# EasyEDA Pro project ProProject_平衡小车_2024-06-28.epro

# Schematic Schematic1
Create Date: 2024-05-16; Page Name: P1; Project Name: 平衡小车; Schematic Name: Schematic1; Update Date: 2024-05-18; Company: 嘉立创EDA; Drawed: bbbsk; Page Size: A4; Reviewed: bbbsk; Version: V1.0
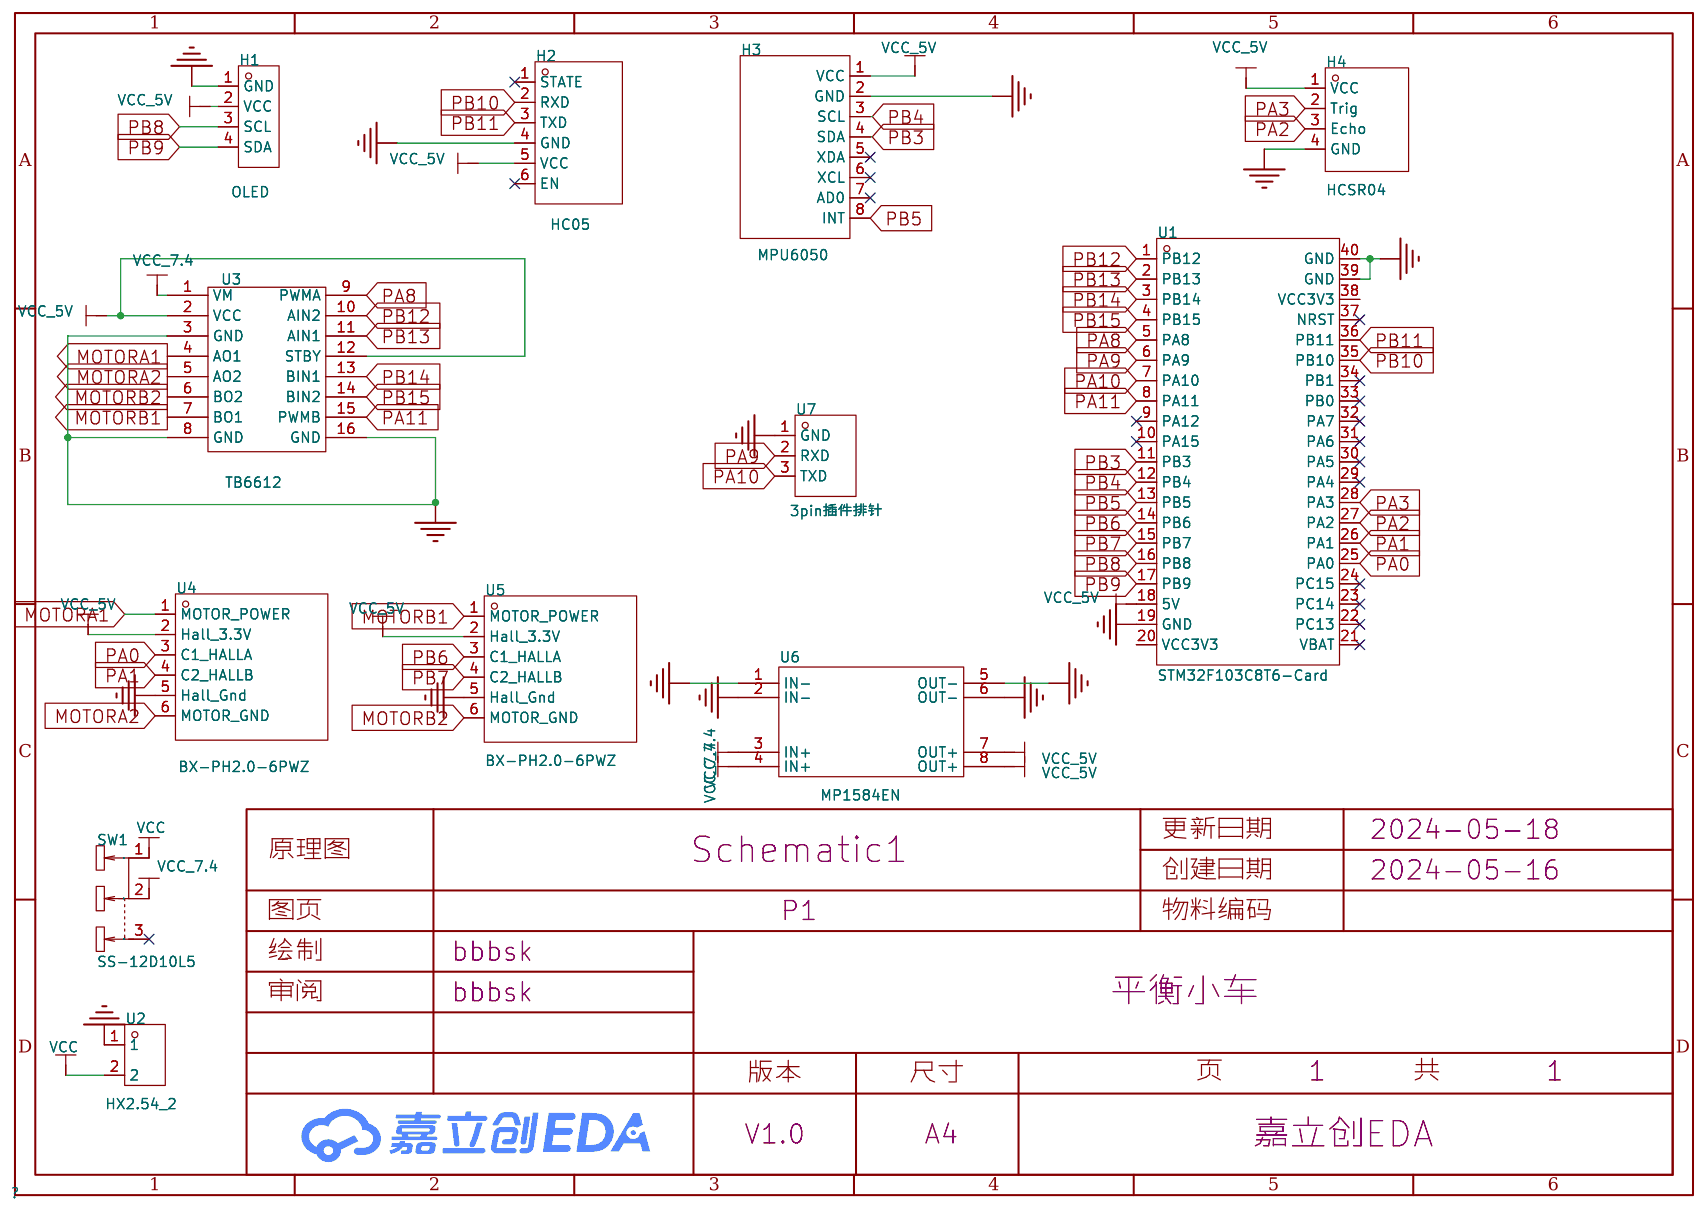
[diagram p0: schematic sheet]

## Parts
H1  OLED  [HDR-TH_4P-P2.54-V-F]
H2  HC05  [HDR-TH_6P-P2.54-V-F]
H3  MPU6050  [HDR-TH_8P-P2.54-V-F-1]
H4  HCSR04  [HDR-TH_4P-P2.54-V-F]
SW1  SS-12D10L5  [SW-TH_SS-12D10L5]
U1  STM32F103C8T6-Card  [CONN-TH_L53.3-W22.9_STM32F103C8T6-CARD]
U2  HX2.54_2  [CONN-TH_2P-P2.50_HX254]
U3  TB6612  [TB6612]
U4  BX-PH2.0-6PWZ  [CONN-TH_6P-P2.00_BX-PH2.0-6PWZ]
U5  BX-PH2.0-6PWZ  [CONN-TH_6P-P2.00_BX-PH2.0-6PWZ]
U6  MP1584EN  [MP1584EN]
U7  3pin插件排针  [HDR-TH_3P-P2.00-V-M]

## Library data of the parts
H1 = OLED排母: 插孔结构:1x4P;间距:2.54mm;行距:-;圆孔/方孔:方孔;安装类型:直插;排数:单排;总孔位数:4P;额定电流:3A;额定电压:-;插孔方向:顶部;塑高:-;触头材质:青铜;触头镀层:-;工作温度范围:-40℃~+105℃;焊接温度(最大值):-;; LCSC Part Name: 间距:2.54mm 1x4P 直插; Supplier Part: C2718488; Manufacturer: BOOMELE(博穆精密); Manufacturer Part: 2.54-1*4P母; Supplier Footprint: 插件,P=2.54mm; JLCPCB Part Class: 扩展库; Datasheet: https://atta.szlcsc.com/upload/public/pdf/source/20210301/C2718488_F4427B881E42CAA8DDB0B1C12B3A522C.pdf; Supplier: LCSC; Holes Structure: 1x4P; Pitch: 2.54mm; Circular Hole / Square Hole: 方孔; Mounting Type: 直插; Number of Rows: 单排; Number of Holes: 4P; Current Rating (Max): 3A; Holes Direction: 顶部; Contact Material: 青铜; Operating Temperature Range: -40℃~+105℃
H2 = HC05: 插孔结构:1x6P;间距:2.54mm;行距:-;安装类型:直插;排数:单排;总孔位数:6P;塑高:-;触头材质:-;触头镀层:-;; LCSC Part Name: 间距:2.54mm 1x6P 直插; Supplier Part: C40877; Manufacturer: BOOMELE(博穆精密); Manufacturer Part: 2.54-1*6P母; Supplier Footprint: 插件,P=2.54mm; JLCPCB Part Class: 扩展库; Datasheet: https://atta.szlcsc.com/upload/public/pdf/source/20210301/C2718488_F4427B881E42CAA8DDB0B1C12B3A522C.pdf; Supplier: LCSC; Holes Structure: 1x6P; Pitch: 2.54mm; Mounting Type: 直插; Number of Rows: 单排; Number of Holes: 6P
H3 = MPU6050: 插孔结构:1x8P;间距:2.54mm;行距:-;安装类型:直插;排数:单排;总孔位数:8P;塑高:-;触头材质:-;触头镀层:-;; LCSC Part Name: 间距:2.54mm 1x8P 直插; Supplier Part: C27438; Manufacturer: BOOMELE(博穆精密); Manufacturer Part: 2.54-1*8P母环保; Supplier Footprint: 插件,P=2.54mm; JLCPCB Part Class: 扩展库; Datasheet: https://atta.szlcsc.com/upload/public/pdf/source/20231221/1CA800C6799ED97958773716FAA1BFFE.pdf; Supplier: LCSC; Holes Structure: 1x8P; Pitch: 2.54mm; Mounting Type: 直插; Number of Rows: 单排; Number of Holes: 8P
H4 = HCSR04: 插孔结构:1x4P;间距:2.54mm;行距:-;圆孔/方孔:方孔;安装类型:直插;排数:单排;总孔位数:4P;额定电流:3A;额定电压:-;插孔方向:顶部;塑高:-;触头材质:青铜;触头镀层:-;工作温度范围:-40℃~+105℃;焊接温度(最大值):-;; LCSC Part Name: 间距:2.54mm 1x4P 直插; Supplier Part: C2718488; Manufacturer: BOOMELE(博穆精密); Manufacturer Part: 2.54-1*4P母; Supplier Footprint: 插件,P=2.54mm; JLCPCB Part Class: 扩展库; Datasheet: https://atta.szlcsc.com/upload/public/pdf/source/20210301/C2718488_F4427B881E42CAA8DDB0B1C12B3A522C.pdf; Supplier: LCSC; Holes Structure: 1x4P; Pitch: 2.54mm; Circular Hole / Square Hole: 方孔; Mounting Type: 直插; Number of Rows: 单排; Number of Holes: 4P; Current Rating (Max): 3A; Holes Direction: 顶部; Contact Material: 青铜; Operating Temperature Range: -40℃~+105℃
SW1 = SS-12D10L5: 电路结构:单刀双掷;安装方式:直插;开关颜色:黑色;额定电流(DC):3A;额定电压(DC):125V;额定电流(AC):3A;额定电压(AC):125V;机械寿命:1万次;; LCSC Part Name: 柄长5mm 直插双档 滑动开关; Supplier Part: C319012; Manufacturer: XKB Connectivity(中国星坤); Supplier Footprint: 插件; JLCPCB Part Class: 扩展库; Datasheet: https://atta.szlcsc.com/upload/public/pdf/source/20211009/D6412F37AABE6F9459A6EE7FA4DAEADB.pdf; Supplier: LCSC; Circuit: 单刀双掷; Actuator Style: 矩形柱状; Pin Style: PC引脚; Switch Length: 13mm; Switch Width: 6.8mm; Switch Height: 6.4mm; Mounting Style: 直插; Actuator Color: 黑色; Current Rating (DC): 3A; Voltage Rating (DC): 125V; Current Rating (AC): 3A; Voltage Rating (AC): 125V; Mechanical Life: 1万次; Operating Temperature: -40℃~+85℃
U1 = STM32F103C8T6-Card: Supplier Part: C9900077949; Supplier Footprint: 插件; Supplier: LCSC
U2 = HX2.54_2: Supplier Part: C9900001962; Supplier Footprint: CONN-TH_2P-P2.50; JLCPCB Part Class: 扩展库; Supplier: LCSC
U3 = TB6612
U4 U5 = BX-PH2.0-6PWZ: 插针结构:1x6P;间距:2mm;安装方式:弯插;参考系列:PH;总PIN数:6P;排数:1;每排PIN数:6;行距:-;额定电流:2A;触头材质:黄铜;触头镀层:锡;工作温度范围:-25℃~+85℃;; Supplier Part: C18077757; Manufacturer: Bossie(博锡); Supplier Footprint: 弯插,P=2mm; JLCPCB Part Class: 扩展库; Datasheet: https://atta.szlcsc.com/upload/public/pdf/source/20231017/ADE7E4C0A5BEBBBF1476E376B8A5AD42.pdf; Supplier: LCSC; Pins Structure: 1x6P; Pitch: 2mm; Mounting Style: 弯插; Reference Series: PH; Number of Pins: 6P; Number of Rows: 1; Number of PINs Per Row: 6; Current Rating (Max): 2A; Contact Material: 黄铜; Contact Plating: 锡; Operating Temperature Range: -25℃~+85℃
U6 = MP1584EN
U7 = 串口调试: Supplier Part: C9900022322; Supplier Footprint: HDR-TH-3P; JLCPCB Part Class: 扩展库; Supplier: LCSC

## Nets
GND: H1.1(GND) H2.4(GND) H3.2(GND) H4.4(GND) U1.19(GND) U1.39(GND) U1.40(GND) U2.1 U3.3(GND) U3.8(GND) U3.16(GND) U4.5(Hall_Gnd) U5.5(Hall_Gnd) U6.1(IN-) U6.2(IN-) U6.5(OUT-) U6.6(OUT-) U7.1(GND)
VCC: SW1.1 U2.2
VCC_5V: H1.2(VCC) H2.5(VCC) H3.1(VCC) H4.1(VCC) U1.18(5V) U3.2(VCC) U3.12(STBY) U4.2(Hall_3.3V) U5.2(Hall_3.3V) U6.7(OUT+) U6.8(OUT+)
VCC_7.4: SW1.2 U3.1(VM) U6.3(IN+) U6.4(IN+)
MOTORA1: U3.4(AO1) U4.1(MOTOR_POWER)
MOTORA2: U3.5(AO2) U4.6(MOTOR_GND)
MOTORB1: U3.7(BO1) U5.1(MOTOR_POWER)
MOTORB2: U3.6(BO2) U5.6(MOTOR_GND)
PA0: U1.25(PA0) U4.3(C1 HALLA)
PA1: U1.26(PA1) U4.4(C2 HALLB)
PA2: H4.3(Echo) U1.27(PA2)
PA3: H4.2(Trig) U1.28(PA3)
PA8: U1.5(PA8) U3.9(PWMA)
PA9: U1.6(PA9) U7.2(RXD)
PA10: U1.7(PA10) U7.3(TXD)
PA11: U1.8(PA11) U3.15(PWMB)
PB3: H3.4(SDA) U1.11(PB3)
PB4: H3.3(SCL) U1.12(PB4)
PB5: H3.8(INT) U1.13(PB5)
PB6: U1.14(PB6) U5.3(C1 HALLA)
PB7: U1.15(PB7) U5.4(C2 HALLB)
PB8: H1.3(SCL) U1.16(PB8)
PB9: H1.4(SDA) U1.17(PB9)
PB10: H2.2(RXD) U1.35(PB10)
PB11: H2.3(TXD) U1.36(PB11)
PB12: U1.1(PB12) U3.10(AIN2)
PB13: U1.2(PB13) U3.11(AIN1)
PB14: U1.3(PB14) U3.13(BIN1)
PB15: U1.4(PB15) U3.14(BIN2)

Not connected (* = marked no-connect by the designer): H2 1(STATE)* 6(EN)*; H3 5(XDA)* 6(XCL)* 7(AD0)*; SW1 3*; U1 9(PA12)* 10(PA15)* 20(VCC3V3) 21(VBAT)* 22(PC13)* 23(PC14)* 24(PC15)* 29(PA4)* 30(PA5)* 31(PA6)* 32(PA7)* 33(PB0)* 34(PB1)* 37(NRST)* 38(VCC3V3)

# Board PCB1
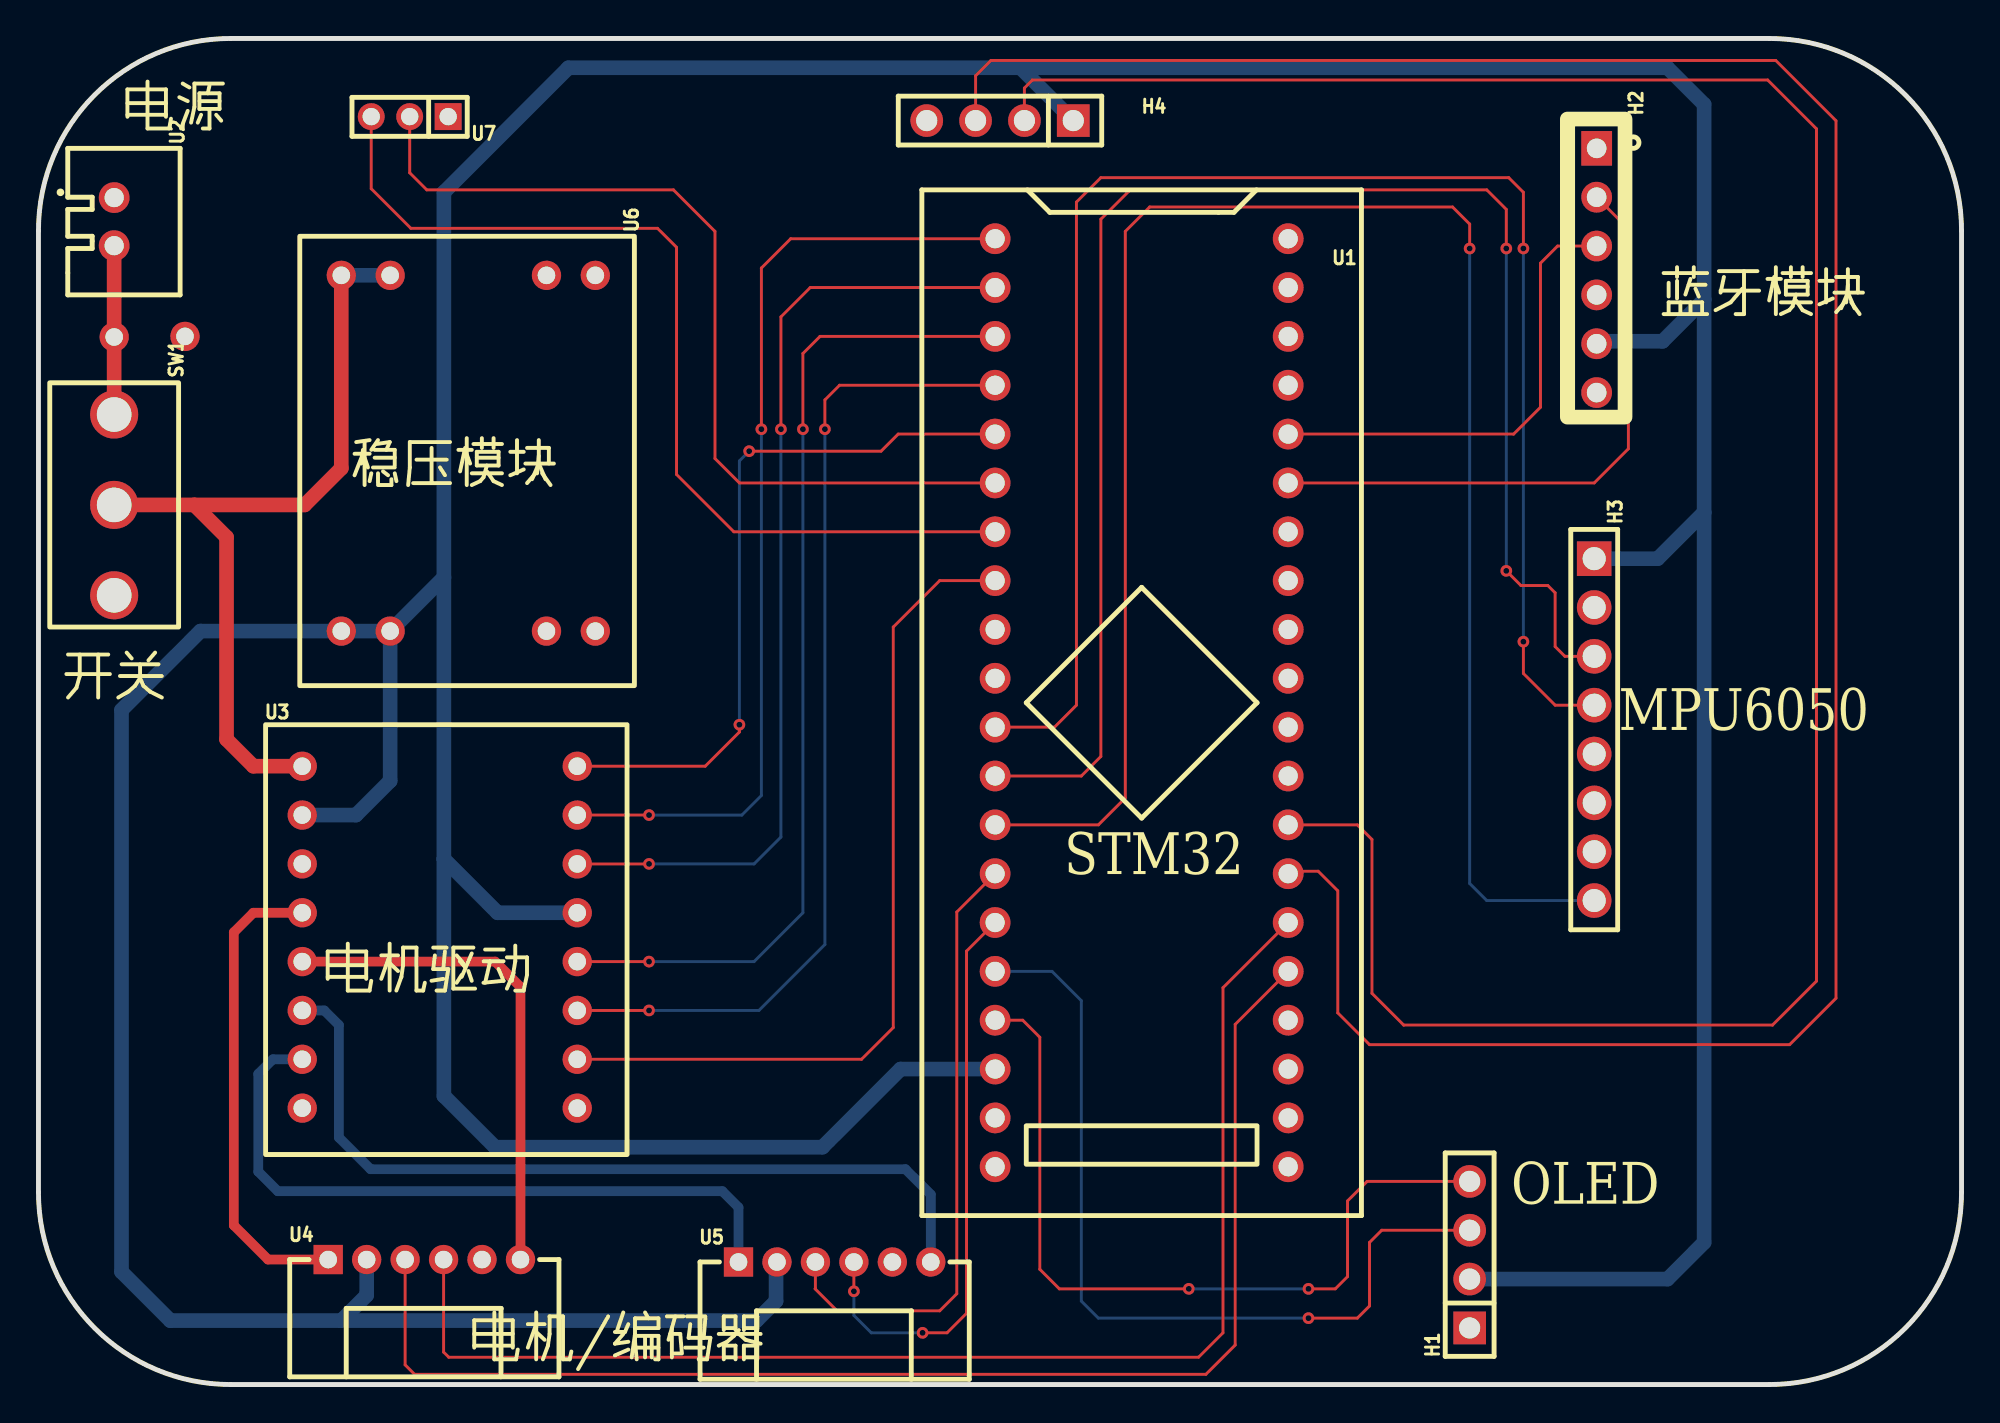
[diagram p1: board, top side]
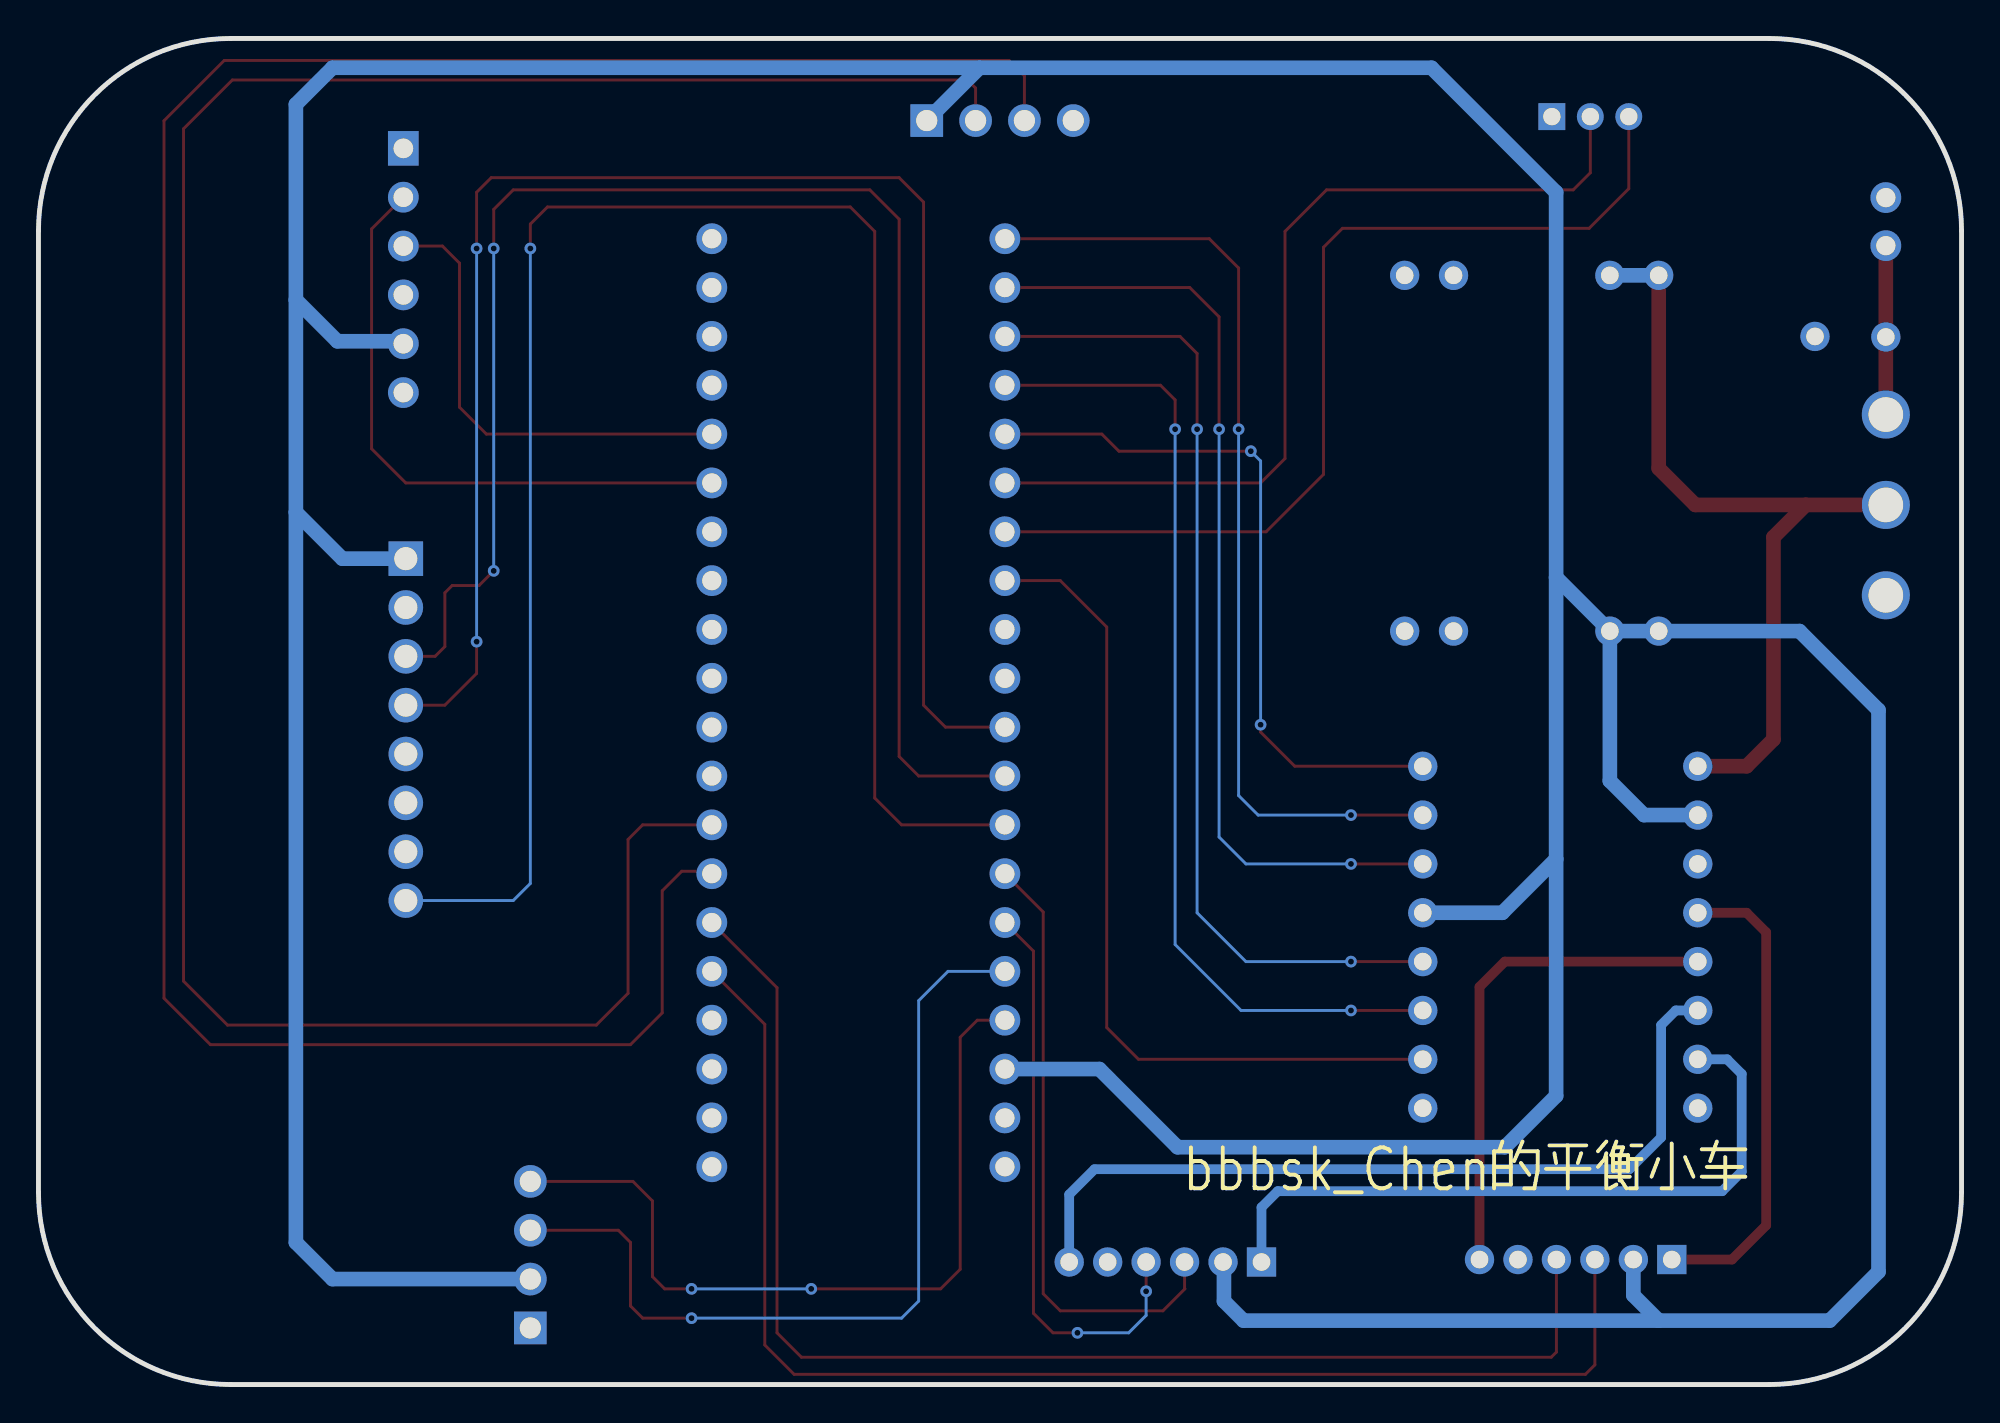
[diagram p2: board, bottom side, seen from below]

Outline 100 x 70 mm; copper layers: Top Layer, Bottom Layer. Coordinates in mm from the lower left corner of the outline.
Outline path: 0,60 0,10 arc(2.93,2.93) 10,0 90,0 arc(97.07,2.93) 100,10 100,60 arc(97.07,67.07) 90,70 10,70 arc(2.93,67.07) 0,60
Stack: Top Layer 0.035mm / Dielectric1 1.51mm FR4 er 4.5 / Bottom Layer 0.035mm

## Design rules (mm)
net GND: pwr
net VCC_7.4: pwr
net VCC_5V: pwr
template: 自定义配置
spacing copperThickness1oz (default): track to track 0.203, other pairs 0.203 to 0.203
spacing copperThickness2oz: track to track 0.203, other pairs 0.152 to 0.3
track width copperThickness1oz (default): min 0.152, default 0.152, max 0.762
track width copperThickness2oz: min 0.203, default 0.254, max 2.54
track width power: min 0.508, default 0.762, max 5.08
differential pair differentialPair (default): width min 0.152, default 0.152, max 0.152; gap min 0.152, default 0.152
via viaSize (default): diameter min 0.61, default 0.61, max 0.61; hole min 0.305, default 0.305, max 0.305
net class pwr uses power
net GND uses power
net VCC_7.4 uses power
net VCC_5V uses power

## Placement (name value [footprint] x y rotation side)
H1  OLED  [HDR-TH_4P-P2.54-V-F]  74.42 6.75 90 top
H2  HC05  [HDR-TH_6P-P2.54-V-F]  81.03 57.94 270 top
H3  MPU6050  [HDR-TH_8P-P2.54-V-F-1]  80.9 34.06 270 top
H4  HCSR04  [HDR-TH_4P-P2.54-V-F]  50 65.73 180 top
NOREF  -  [Pad_e75718]  3.94 54.48 0 top
NOREF#2  -  [Pad_e75725]  7.62 54.51 0 top
SW1  SS-12D10L5  [SW-TH_SS-12D10L5]  3.94 45.74 270 top
U1  STM32F103C8T6-Card  [CONN-TH_L53.3-W22.9_STM32F103C8T6-CARD]  57.37 35.46 270 top
U2  HX2.54_2  [CONN-TH_2P-P2.50_HX254]  3.94 60.47 270 top
U3  -  [TB6612]  13.72 25.8 0 top
U4  BX-PH2.0-6PWZ  [CONN-TH_6P-P2.00_BX-PH2.0-6PWZ]  20.07 6.5 0 top
U5  BX-PH2.0-6PWZ  [CONN-TH_6P-P2.00_BX-PH2.0-6PWZ]  41.4 6.37 0 top
U6  -  [MP1584EN]  28.96 57.68 270 top
U7  3pin插件排针  [HDR-TH_3P-P2.00-V-M]  19.3 65.94 180 top

## Footprints (pads in the part's own frame, mm; a bottom-side part is the same pattern mirrored in y, then rotated)
CONN-TH_2P-P2.50_HX254
  round 1.6 hole 1: 1(-1.25,0) 2(1.25,0)
CONN-TH_6P-P2.00_BX-PH2.0-6PWZ
  rect 1.524x1.524 hole 0.914: 1(-5,0)
  round 1.524 hole 0.914: 2(-3,0) 3(-1,0) 4(1,0) 5(3,0) 6(5,0)
CONN-TH_L53.3-W22.9_STM32F103C8T6-CARD
  round 1.6 hole 1: 1(-24.13,-7.62) 2(-21.59,-7.62) 3(-19.05,-7.62) 4(-16.51,-7.62) 5(-13.97,-7.62) 6(-11.43,-7.62) 7(-8.89,-7.62) 8(-6.35,-7.62) 9(-3.81,-7.62) 10(-1.27,-7.62) 11(1.27,-7.62) 12(3.81,-7.62) 13(6.35,-7.62) 14(8.89,-7.62) 15(11.43,-7.62) 16(13.97,-7.62) 17(16.51,-7.62) 18(19.05,-7.62) 19(21.59,-7.62) 20(24.13,-7.62) 21(24.13,7.62) 22(21.59,7.62) 23(19.05,7.62) 24(16.51,7.62) 25(13.97,7.62) 26(11.43,7.62) 27(8.89,7.62) 28(6.35,7.62) 29(3.81,7.62) 30(1.27,7.62) 31(-1.27,7.62) 32(-3.81,7.62) 33(-6.35,7.62) 34(-8.89,7.62) 35(-11.43,7.62) 36(-13.97,7.62) 37(-16.51,7.62) 38(-19.05,7.62) 39(-21.59,7.62) 40(-24.13,7.62)
HDR-TH_3P-P2.00-V-M
  rect 1.4x1.4 hole 0.9: 1(-2,0)
  round 1.4 hole 0.9: 2(0,0) 3(2,0)
HDR-TH_4P-P2.54-V-F
  rect 1.7x1.7 hole 1.1: 1(-3.81,0)
  round 1.7 hole 1.1: 2(-1.27,0) 3(1.27,0) 4(3.81,0)
HDR-TH_6P-P2.54-V-F
  rect 1.8x1.6 hole 1.02: 1(-6.35,0)
  round 1.6 hole 1.02: 2(-3.81,0) 3(-1.27,0) 4(1.27,0) 5(3.81,0) 6(6.35,0)
HDR-TH_8P-P2.54-V-F-1
  rect 1.8x1.8 hole 1.2: 1(-8.89,0)
  round 1.8 hole 1.2: 2(-6.35,0) 3(-3.81,0) 4(-1.27,0) 5(1.27,0) 6(3.81,0) 7(6.35,0) 8(8.89,0)
MP1584EN
  round 1.524 hole 0.914: 1(0,0) 2(0,-2.54) 3(0,-10.668) 4(0,-13.208) 5(18.5,0) 6(18.5,-2.54) 7(18.5,-10.668) 8(18.5,-13.208)
Pad_e75718
  round 1.524 hole 0.914: 41(0,0)
Pad_e75725
  round 1.524 hole 0.914: 42(0,0)
SW-TH_SS-12D10L5
  round 2.5 hole 1.8: 1(-4.7,0) 2(0,0) 3(4.7,0)
TB6612
  round 1.524 hole 0.914: 1(0,6.35) 2(0,3.81) 3(0,1.27) 4(0,-1.27) 5(0,-3.81) 6(0,-6.35) 7(0,-8.89) 8(0,-11.43) 9(14.3,6.35) 10(14.3,3.81) 11(14.3,1.27) 12(14.3,-1.27) 13(14.3,-3.81) 14(14.3,-6.35) 15(14.3,-8.89) 16(14.3,-11.43)

## Nets
As in the schematic, except:
GND: H1.1 H2.4 H3.2 H4.4 NOREF#2.42 U1.19 U1.39 U1.40 U2.1 U3.3 U3.8 U3.16 U4.5 U5.5 U6.1 U6.2 U6.5 U6.6 U7.1
VCC: NOREF.41 SW1.1 U2.2

Pads without a net: H2 1 6; H3 5 6 7; SW1 3; U1 9 10 20 21 22 23 24 29 30 31 32 33 34 37 38

## Via types
v1: diameter 0.61, hole 0.305, Top Layer to Bottom Layer, 20 vias

## Routing (per net, layer and track width the routed paths; a pad name or vN(x,y) marks a point on that pad's centre or on a via; arc(x,y) is an arc through that point)
VCC: length 8.8
  Top Layer w0.762: U2.2 SW1.1
VCC_5V: length 348.2
  Bottom Layer w0.762: U6.7 U6.8 8.42,39.18 4.32,35.08 4.32,5.87 6.86,3.32 15.75,3.32 ; U6.7 21.08,41.97 ; U6.7 18.29,31.39 16.51,29.61 U3.2 ; 86.61,45.36 84.2,42.95 H3.1 ; 86.61,45.36 86.61,7.39 84.71,5.48 H1.2 ; 86.61,45.36 86.61,56.41 ; 86.61,56.41 86.61,66.57 84.71,68.48 51.06,68.48 ; 86.61,56.41 84.46,54.25 81.15,54.25 H2.5 ; U4.2 17.07,4.64 15.75,3.32 ; 15.75,3.32 37.34,3.32 38.35,4.34 38.35,6.45 38.4,6.5 ; 51.06,68.48 H4.1 ; 51.06,68.48 27.56,68.48 21.08,62 21.08,41.97 ; U1.18 44.83,16.41 40.77,12.34 23.75,12.34 21.08,15.01 21.08,27.33 ; 21.08,27.33 23.88,24.53 U3.12 ; 21.08,27.33 21.08,41.97
VCC_7.4: length 42.6
  Top Layer w0.762: 8.1,45.74 9.78,44.07 9.78,33.55 11.18,32.15 U3.1 ; 8.1,45.74 13.84,45.74 15.75,47.65 U6.4 ; 8.1,45.74 SW1.2
  Bottom Layer w0.762: U6.4 U6.3
MOTORA1: length 24.9
  Top Layer w0.508: U4.1 11.94,6.5 10.16,8.28 10.16,23.52 11.18,24.53 U3.4
MOTORA2: length 26.1
  Top Layer w0.508: U3.5 23.75,21.99 25.07,20.68 U4.6
MOTORB1: length 36.1
  Bottom Layer w0.508: 36.4,6.5 36.4,9.21 35.56,10.06 12.45,10.06 11.43,11.07 11.43,16.15 12.19,16.91 U3.7
MOTORB2: length 43.5
  Bottom Layer w0.508: 46.4,6.5 46.4,9.88 45.09,11.2 17.27,11.2 15.62,12.85 15.62,18.69 14.86,19.45 U3.6
PA0: length 70
  Top Layer w0.152: U4.3 19.07,1.02 19.56,0.53 60.71,0.53 62.23,2.06 62.23,18.73 U1.25
PA1: length 68.7
  Top Layer w0.152: U1.26 61.59,20.64 61.59,2.69 60.32,1.42 21.34,1.42 21.07,1.69 U4.4
PA2: length 131.3
  Top Layer w0.152: U1.27 65.11,26.69 66.55,26.69 67.56,25.68 67.56,19.33 69.22,17.68 91.06,17.68 93.47,20.09 93.47,65.72 90.34,68.86 49.53,68.86 48.73,68.06 H4.3
PA3: length 125.8
  Top Layer w0.152: U1.28 68.58,29.11 69.34,28.34 69.34,20.34 70.99,18.69 90.17,18.69 92.46,20.98 92.46,65.3 89.92,67.84 51.69,67.84 51.27,67.42 H4.2
PA8: length 37.1
  Top Layer w0.152: U3.9 34.67,32.15 36.45,33.93 v1(36.45,34.31) ; U1.5 44.7,49.43 43.81,48.54 v1(36.96,48.54)
  Bottom Layer w0.152: v1(36.45,34.31) 36.45,48.03 v1(36.96,48.54)
PA9: length 47
  Top Layer w0.152: U1.6 36.45,46.89 35.18,48.16 35.18,59.97 33.02,62.13 20.19,62.13 19.3,63.02 U7.2
PA10: length 50.5
  Top Layer w0.152: U1.7 36.16,44.35 33.18,47.33 33.18,59.14 32.19,60.13 19.36,60.13 17.3,62.19 U7.3
PA11: length 44.2
  Top Layer w0.152: U3.15 42.8,16.91 44.45,18.56 44.45,39.39 46.86,41.81 U1.8
PB3: length 84.3
  Top Layer w0.152: H3.4 78.87,35.33 77.22,36.98 v1(77.22,38.63) ; U1.11 52.83,34.19 53.97,35.33 53.97,61.49 55.25,62.76 76.45,62.76 77.22,62 v1(77.22,59.08)
  Bottom Layer w0.152: v1(77.22,38.63) v1(77.22,59.08)
PB4: length 82.8
  Top Layer w0.152: v1(76.33,59.08) 76.33,61.11 75.31,62.13 56.77,62.13 55.25,60.6 55.25,32.66 54.23,31.65 U1.12 ; v1(76.33,42.31) 77.09,41.55 78.49,41.55 78.87,41.17 78.87,38.38 79.38,37.87 H3.3
  Bottom Layer w0.152: v1(76.33,42.31) v1(76.33,59.08)
PB5: length 96.7
  Top Layer w0.152: v1(74.42,59.08) 74.42,60.35 73.53,61.24 57.78,61.24 56.51,59.97 56.51,30.5 55.12,29.11 U1.13
  Bottom Layer w0.152: v1(74.42,59.08) 74.42,26.06 75.31,25.17 H3.8
PB6: length 32.4
  Top Layer w0.152: 40.4,6.5 40.4,4.99 40.39,4.98 41.53,3.83 46.86,3.83 47.75,4.72 47.75,24.57 U1.14
PB7: length 30.5
  Top Layer w0.152: v1(42.4,4.85) 42.4,6.5 ; U1.15 48.26,22.54 48.26,3.71 47.24,2.69 v1(45.97,2.69)
  Bottom Layer w0.152: v1(42.4,4.85) 42.4,3.59 43.31,2.69 v1(45.97,2.69)
PB8: length 45.1
  Top Layer w0.152: v1(66.04,3.45) 68.58,3.45 69.22,4.09 69.22,7.39 69.85,8.02 H1.3
  Bottom Layer w0.152: U1.16 52.71,21.49 54.23,19.96 54.23,4.34 55.12,3.45 v1(66.04,3.45)
PB9: length 42.2
  Top Layer w0.152: v1(66.04,4.98) 67.44,4.98 68.07,5.61 68.07,9.55 69.09,10.56 H1.4 ; v1(59.82,4.98) 53.09,4.98 52.07,5.99 52.07,18.06 51.18,18.95 U1.17
  Bottom Layer w0.152: v1(66.04,4.98) v1(59.82,4.98)
PB10: length 32.2
  Top Layer w0.152: H2.2 82.68,60.09 82.68,48.66 80.9,46.89 U1.35
PB11: length 24.5
  Top Layer w0.152: U1.36 76.71,49.43 78.1,50.82 78.1,58.32 78.99,59.2 H2.3
PB12: length 50.2
  Top Layer w0.152: v1(37.59,49.68) 37.59,58.06 39.12,59.59 U1.1 ; U3.10 v1(31.75,29.61)
  Bottom Layer w0.152: v1(31.75,29.61) 36.58,29.61 37.59,30.63 v1(37.59,49.68)
PB13: length 50
  Top Layer w0.152: U1.2 40.13,57.05 38.61,55.52 v1(38.61,49.68) ; U3.11 v1(31.75,27.07)
  Bottom Layer w0.152: v1(31.75,27.07) 37.21,27.07 38.61,28.47 v1(38.61,49.68)
PB14: length 52.2
  Top Layer w0.152: v1(39.75,49.68) 39.75,53.62 40.64,54.51 U1.3 ; U3.13 v1(31.75,21.99)
  Bottom Layer w0.152: v1(39.75,49.68) 39.75,24.53 37.21,21.99 v1(31.75,21.99)
PB15: length 51.8
  Top Layer w0.152: U1.4 41.66,51.97 40.89,51.2 v1(40.89,49.68) ; U3.14 v1(31.75,19.45)
  Bottom Layer w0.152: v1(40.89,49.68) 40.89,22.88 37.47,19.45 v1(31.75,19.45)

## Text on the board
Bottom Silkscreen Layer: bbbsk_Chen的平衡小车
Top Silkscreen Layer: 开关 | 电源 | 电机驱动 | 稳压模块 | 电机/编码器 | STM32 | OLED | MPU6050 | 蓝牙模块
